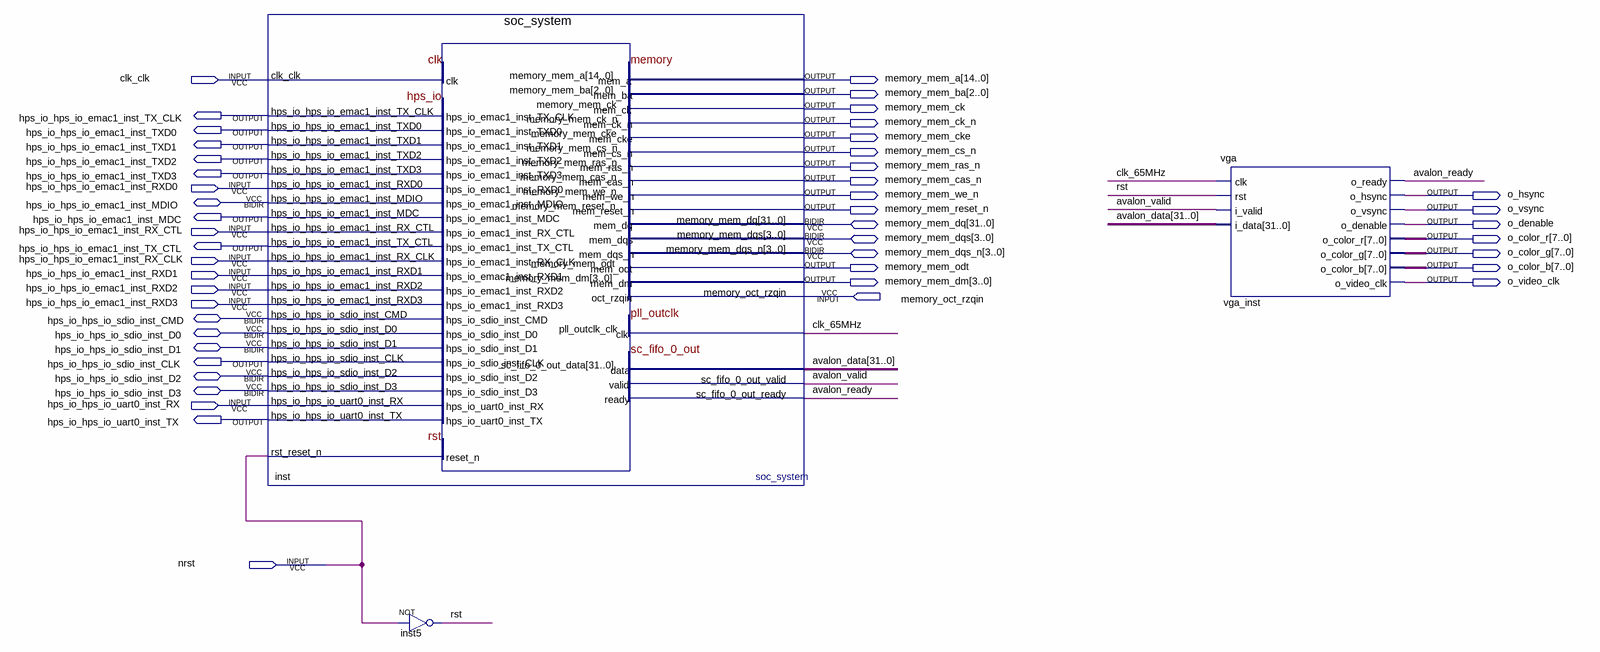
[diagram p0: schematic sheet]
// Quartus schematic main.bdf as structural Verilog: 3 symbols, 47 pins
module main (
  input  clk_clk,
  input  hps_io_hps_io_emac1_inst_RXD0,
  input  hps_io_hps_io_emac1_inst_RX_CTL,
  input  hps_io_hps_io_emac1_inst_RX_CLK,
  input  hps_io_hps_io_emac1_inst_RXD1,
  input  hps_io_hps_io_emac1_inst_RXD2,
  input  memory_oct_rzqin,
  input  hps_io_hps_io_emac1_inst_RXD3,
  input  hps_io_hps_io_uart0_inst_RX,
  input  nrst,
  inout  hps_io_hps_io_emac1_inst_MDIO,
  inout  [31:0] memory_mem_dq,
  inout  [3:0] memory_mem_dqs,
  inout  [3:0] memory_mem_dqs_n,
  inout  hps_io_hps_io_sdio_inst_CMD,
  inout  hps_io_hps_io_sdio_inst_D0,
  inout  hps_io_hps_io_sdio_inst_D1,
  inout  hps_io_hps_io_sdio_inst_D2,
  inout  hps_io_hps_io_sdio_inst_D3,
  output [14:0] memory_mem_a,
  output [2:0] memory_mem_ba,
  output memory_mem_ck,
  output hps_io_hps_io_emac1_inst_TX_CLK,
  output memory_mem_ck_n,
  output hps_io_hps_io_emac1_inst_TXD0,
  output memory_mem_cke,
  output hps_io_hps_io_emac1_inst_TXD1,
  output memory_mem_cs_n,
  output hps_io_hps_io_emac1_inst_TXD2,
  output memory_mem_ras_n,
  output hps_io_hps_io_emac1_inst_TXD3,
  output memory_mem_cas_n,
  output memory_mem_we_n,
  output o_hsync,
  output memory_mem_reset_n,
  output o_vsync,
  output hps_io_hps_io_emac1_inst_MDC,
  output o_denable,
  output [7:0] o_color_r,
  output hps_io_hps_io_emac1_inst_TX_CTL,
  output [7:0] o_color_g,
  output memory_mem_odt,
  output [7:0] o_color_b,
  output [3:0] memory_mem_dm,
  output o_video_clk,
  output hps_io_hps_io_sdio_inst_CLK,
  output hps_io_hps_io_uart0_inst_TX
);

  wire avalon_ready, avalon_valid, clk_65MHz, rst;
  wire [31:0] avalon_data;

  soc_system inst (
    .clk_clk(clk_clk), .hps_io_hps_io_emac1_inst_RXD0(hps_io_hps_io_emac1_inst_RXD0),
    .hps_io_hps_io_emac1_inst_RX_CTL(hps_io_hps_io_emac1_inst_RX_CTL),
    .hps_io_hps_io_emac1_inst_RX_CLK(hps_io_hps_io_emac1_inst_RX_CLK),
    .hps_io_hps_io_emac1_inst_RXD1(hps_io_hps_io_emac1_inst_RXD1),
    .hps_io_hps_io_emac1_inst_RXD2(hps_io_hps_io_emac1_inst_RXD2),
    .hps_io_hps_io_emac1_inst_RXD3(hps_io_hps_io_emac1_inst_RXD3),
    .hps_io_hps_io_uart0_inst_RX(hps_io_hps_io_uart0_inst_RX), .memory_oct_rzqin(memory_oct_rzqin),
    .rst_reset_n(nrst), .sc_fifo_0_out_ready(avalon_ready),
    .hps_io_hps_io_emac1_inst_TX_CLK(hps_io_hps_io_emac1_inst_TX_CLK),
    .hps_io_hps_io_emac1_inst_TXD0(hps_io_hps_io_emac1_inst_TXD0),
    .hps_io_hps_io_emac1_inst_TXD1(hps_io_hps_io_emac1_inst_TXD1),
    .hps_io_hps_io_emac1_inst_TXD2(hps_io_hps_io_emac1_inst_TXD2),
    .hps_io_hps_io_emac1_inst_TXD3(hps_io_hps_io_emac1_inst_TXD3),
    .hps_io_hps_io_emac1_inst_MDC(hps_io_hps_io_emac1_inst_MDC),
    .hps_io_hps_io_emac1_inst_TX_CTL(hps_io_hps_io_emac1_inst_TX_CTL),
    .hps_io_hps_io_sdio_inst_CLK(hps_io_hps_io_sdio_inst_CLK),
    .hps_io_hps_io_uart0_inst_TX(hps_io_hps_io_uart0_inst_TX), .memory_mem_a(memory_mem_a),
    .memory_mem_ba(memory_mem_ba), .memory_mem_ck(memory_mem_ck), .memory_mem_ck_n(memory_mem_ck_n),
    .memory_mem_cke(memory_mem_cke), .memory_mem_cs_n(memory_mem_cs_n), .memory_mem_ras_n(memory_mem_ras_n),
    .memory_mem_cas_n(memory_mem_cas_n), .memory_mem_we_n(memory_mem_we_n),
    .memory_mem_reset_n(memory_mem_reset_n), .memory_mem_odt(memory_mem_odt), .memory_mem_dm(memory_mem_dm),
    .pll_outclk_clk(clk_65MHz), .sc_fifo_0_out_data(avalon_data), .sc_fifo_0_out_valid(avalon_valid),
    .hps_io_hps_io_emac1_inst_MDIO(hps_io_hps_io_emac1_inst_MDIO),
    .hps_io_hps_io_sdio_inst_CMD(hps_io_hps_io_sdio_inst_CMD),
    .hps_io_hps_io_sdio_inst_D0(hps_io_hps_io_sdio_inst_D0),
    .hps_io_hps_io_sdio_inst_D1(hps_io_hps_io_sdio_inst_D1),
    .hps_io_hps_io_sdio_inst_D2(hps_io_hps_io_sdio_inst_D2),
    .hps_io_hps_io_sdio_inst_D3(hps_io_hps_io_sdio_inst_D3), .memory_mem_dq(memory_mem_dq),
    .memory_mem_dqs(memory_mem_dqs), .memory_mem_dqs_n(memory_mem_dqs_n));
  not inst5 (rst, nrst);
  vga vga_inst (
    .clk(clk_65MHz), .rst(rst), .i_valid(avalon_valid), .i_data(avalon_data), .o_ready(avalon_ready),
    .o_hsync(o_hsync), .o_vsync(o_vsync), .o_denable(o_denable), .o_color_r(o_color_r),
    .o_color_g(o_color_g), .o_color_b(o_color_b), .o_video_clk(o_video_clk));
endmodule
